# Altium schematic sheet 1-MCU.SchDoc
size A3
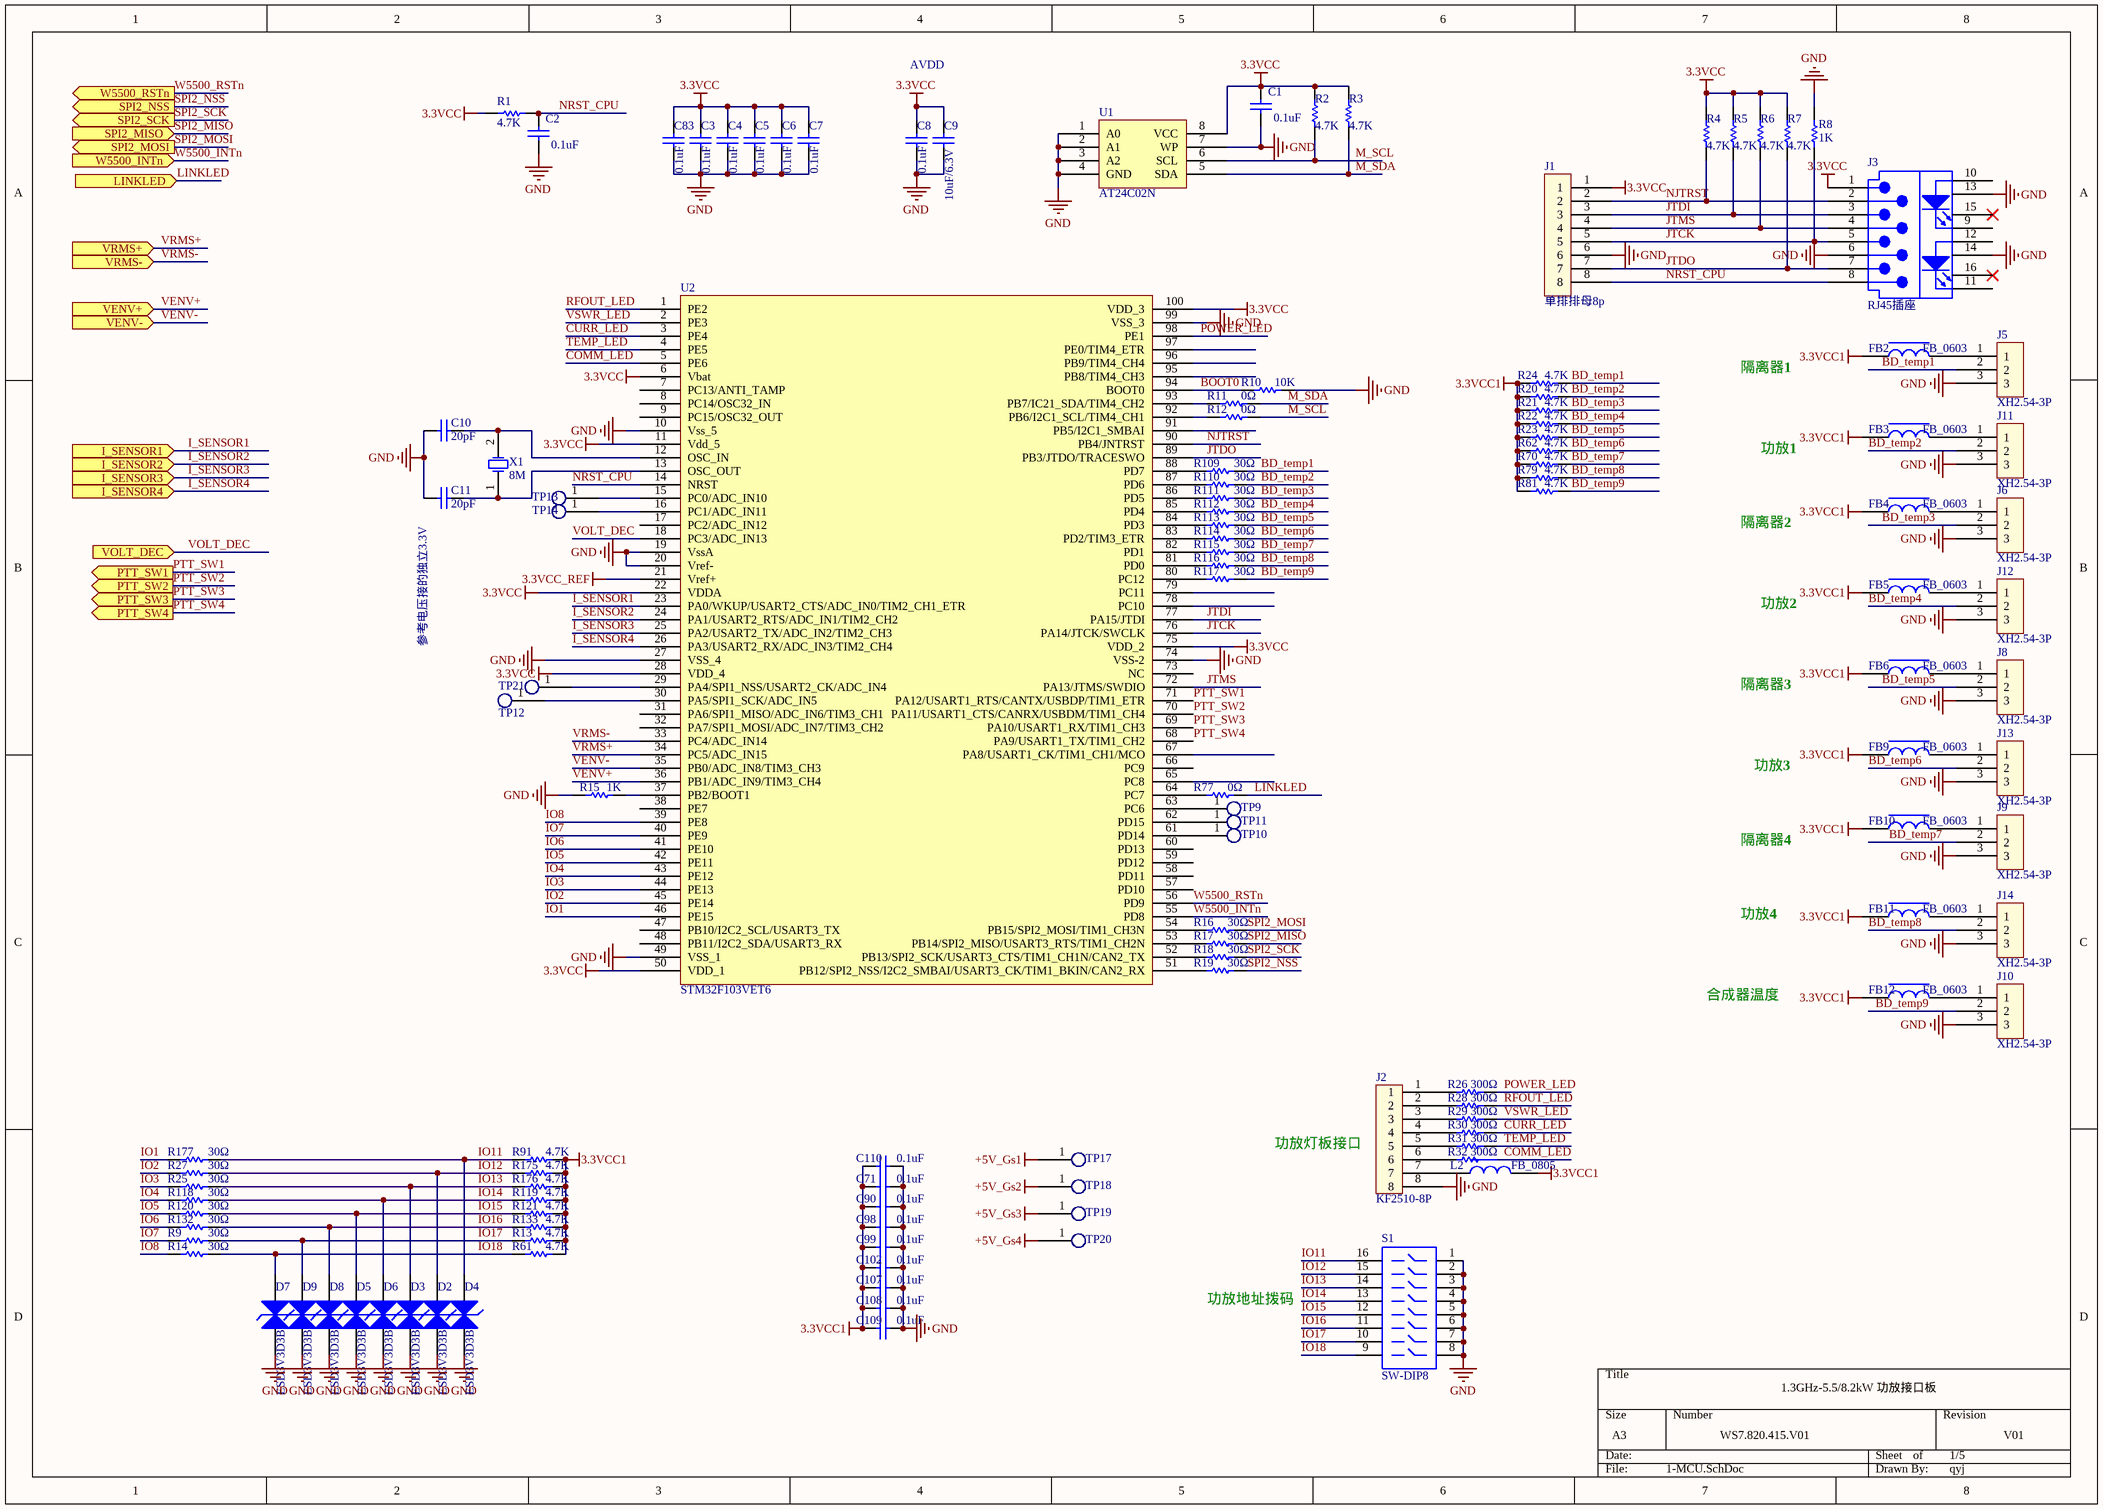
[diagram p0: 1-MCU.SchDoc]

## Parts
C1  0.1uF  [C0603]
C2  0.1uF  [C0603]
C3  0.1uF  [C0603]
C4  0.1uF  [C0603]
C5  0.1uF  [C0603]
C6  0.1uF  [C0603]
C7  0.1uF  [C0603]
C8  0.1uF  [C0603]
C9  10uF/6.3V  [C0603]
C10  20pF  [C0603]
C11  20pF  [C0603]
C71  0.1uF  [C0603]
C83  0.1uF  [C0603]
C90  0.1uF  [C0603]
C98  0.1uF  [C0603]
C99  0.1uF  [C0603]
C102  0.1uF  [C0603]
C107  0.1uF  [C0603]
C108  0.1uF  [C0603]
C109  0.1uF  [C0603]
C110  0.1uF  [C0603]
D2  ESD3V3D3B  [SOD-323]
D3  ESD3V3D3B  [SOD-323]
D4  ESD3V3D3B  [SOD-323]
D5  ESD3V3D3B  [SOD-323]
D6  ESD3V3D3B  [SOD-323]
D7  ESD3V3D3B  [SOD-323]
D8  ESD3V3D3B  [SOD-323]
D9  ESD3V3D3B  [SOD-323]
FB2  FB_0603  [L0603]
FB3  FB_0603  [L0603]
FB4  FB_0603  [L0603]
FB5  FB_0603  [L0603]
FB6  FB_0603  [L0603]
FB9  FB_0603  [L0603]
FB10  FB_0603  [L0603]
FB11  FB_0603  [L0603]
FB12  FB_0603  [L0603]
J1  单排排母8p  [SIP8TM-2R54]
J2  KF2510-8P  [KF2510-8P -2R54-20R32x6R0-wanzhen]
J3  RJ45插座  [RJ45TH-1x1-2R54-LED]
J5  XH2.54-3P  [XH2.54mm-10R0x7R0--zhizhen]
J6  XH2.54-3P  [XH2.54mm-10R0x7R0--zhizhen]
J8  XH2.54-3P  [XH2.54mm-10R0x7R0--zhizhen]
J9  XH2.54-3P  [XH2.54mm-10R0x7R0--zhizhen]
J10  XH2.54-3P  [XH2.54mm-10R0x7R0--zhizhen]
J11  XH2.54-3P  [XH2.54mm-10R0x7R0--zhizhen]
J12  XH2.54-3P  [XH2.54mm-10R0x7R0--zhizhen]
J13  XH2.54-3P  [XH2.54mm-10R0x7R0--zhizhen]
J14  XH2.54-3P  [XH2.54mm-10R0x7R0--zhizhen]
L2  FB_0805  [L0805]
R1  4.7K  [R0603]
R2  4.7K  [R0603]
R3  4.7K  [R0603]
R4  4.7K  [R0603]
R5  4.7K  [R0603]
R6  4.7K  [R0603]
R7  4.7K  [R0603]
R8  1K  [R0603]
R9  30Ω  [R0603]
R10  10K  [R0603]
R11  0Ω  [R0603]
R12  0Ω  [R0603]
R13  4.7K  [R0603]
R14  30Ω  [R0603]
R15  1K  [R0603]
R16  30Ω  [R0603]
R17  30Ω  [R0603]
R18  30Ω  [R0603]
R19  30Ω  [R0603]
R20  4.7K  [R0603]
R21  4.7K  [R0603]
R22  4.7K  [R0603]
R23  4.7K  [R0603]
R24  4.7K  [R0603]
R25  30Ω  [R0603]
R26  300Ω  [R0603]
R27  30Ω  [R0603]
R28  300Ω  [R0603]
R29  300Ω  [R0603]
R30  300Ω  [R0603]
R31  300Ω  [R0603]
R32  300Ω  [R0603]
R61  4.7K  [R0603]
R62  4.7K  [R0603]
R70  4.7K  [R0603]
R77  0Ω  [R0603]
R79  4.7K  [R0603]
R81  4.7K  [R0603]
R91  4.7K  [R0603]
R109  30Ω  [R0603]
R110  30Ω  [R0603]
R111  30Ω  [R0603]
R112  30Ω  [R0603]
R113  30Ω  [R0603]
R114  30Ω  [R0603]
R115  30Ω  [R0603]
R116  30Ω  [R0603]
R117  30Ω  [R0603]
R118  30Ω  [R0603]
R119  4.7K  [R0603]
R120  30Ω  [R0603]
R121  4.7K  [R0603]
R132  30Ω  [R0603]
R133  4.7K  [R0603]
R175  4.7K  [R0603]
R176  4.7K  [R0603]
R177  30Ω  [R0603]
S1  SW-DIP8  [DIP-16-KEY]
TP9  TEST  [TP0R8]  (value not drawn)  (no BOM)
TP10  TEST  [TP0R8]  (value not drawn)  (no BOM)
TP11  TEST  [TP0R8]  (value not drawn)  (no BOM)
TP12  TEST  [TP0R8]  (value not drawn)  (no BOM)
TP13  TEST  [TP0R8]  (value not drawn)  (no BOM)
TP14  TEST  [TP0R8]  (value not drawn)  (no BOM)
TP17  (no value)  [TP2R54mm]  (no BOM)
TP18  (no value)  [TP2R54mm]  (no BOM)
TP19  (no value)  [TP2R54mm]  (no BOM)
TP20  (no value)  [TP2R54mm]  (no BOM)
TP21  TEST  [TP0R8]  (value not drawn)  (no BOM)
U1  AT24C02N  [SOIC8_1R27_3R9x4R9]
U2  STM32F103VET6  [LQFP100_0R5_14x14]
X1  8M  [CRY2SM-6R0x3R5]

## Ports
I_SENSOR1 (in), I_SENSOR2 (in), I_SENSOR3 (in), I_SENSOR4 (in), LINKLED (in), PTT_SW1 (out), PTT_SW2 (out), PTT_SW3 (out), PTT_SW4 (out), SPI2_MISO (in), SPI2_MOSI (out), SPI2_NSS (out), SPI2_SCK (out), VENV+ (in), VENV- (in), VOLT_DEC (in), VRMS+ (in), VRMS- (in), W5500_INTn (in), W5500_RSTn (out)

## Nets
3.3VCC: C1.2 C3.2 C4.2 C5.2 C6.2 C7.2 C8.2 C9.2 C83.2 J1.1 J3.1(TX+) R1.2 R2.2 R3.2 R4.2 R5.2 R6.2 R7.2 U1.8(VCC) U2.6(Vbat) U2.11(Vdd_5) U2.22(VDDA) U2.28(VDD_4) U2.50(VDD_1) U2.75(VDD_2) U2.100(VDD_3)
3.3VCC1: C71.1 C90.1 C98.1 C99.1 C102.1 C107.1 C108.1 C109.1 C110.1 FB2.1 FB3.1 FB4.1 FB5.1 FB6.1 FB9.1 FB10.1 FB11.1 FB12.1 L2.2 R13.1 R20.1 R21.1 R22.1 R23.1 R24.1 R61.1 R62.1 R70.1 R79.1 R81.1 R91.1 R119.1 R121.1 R133.1 R175.1 R176.1
3.3VCC_REF: U2.21(Vref+)
+5V_Gs1: TP17.1(TP)
+5V_Gs2: TP18.1(TP)
+5V_Gs3: TP19.1(TP)
+5V_Gs4: TP20.1(TP)
GND: C1.1 C2.1 C3.1 C4.1 C5.1 C6.1 C7.1 C8.1 C9.1 C10.2 C11.2 C71.2 C83.1 C90.2 C98.2 C99.2 C102.2 C107.2 C108.2 C109.2 C110.2 D2.2 D3.2 D4.2 D5.2 D6.2 D7.2 D8.2 D9.2 J1.6 J2.8 J3.6(RX-) J3.13 J3.14 J5.3 J6.3 J8.3 J9.3 J10.3 J11.3 J12.3 J13.3 J14.3 R8.1 R10.1 R15.1 S1.1 S1.2 S1.3 S1.4 S1.5 S1.6 S1.7 S1.8 U1.1(A0) U1.2(A1) U1.3(A2) U1.4(GND) U1.7(WP) U2.10(Vss_5) U2.19(VssA) U2.20(Vref-) U2.27(VSS_4) U2.49(VSS_1) U2.74(VSS-2) U2.99(VSS_3)
BD_temp1: J5.2 R24.2 R109.2
BD_temp2: J11.2 R20.2 R110.2
BD_temp3: J6.2 R21.2 R111.2
BD_temp4: J12.2 R22.2 R112.2
BD_temp5: J8.2 R23.2 R113.2
BD_temp6: J13.2 R62.2 R114.2
BD_temp7: J9.2 R70.2 R115.2
BD_temp8: J14.2 R79.2 R116.2
BD_temp9: J10.2 R81.2 R117.2
BOOT0: R10.2 U2.94(BOOT0)
COMM_LED: R32.2 U2.5(PE6)
CURR_LED: R30.2 U2.3(PE4)
I_SENSOR1: U2.23(PA0/WKUP/USART2_CTS/ADC_IN0/TIM2_CH1_ETR) ; port I_SENSOR1
I_SENSOR2: U2.24(PA1/USART2_RTS/ADC_IN1/TIM2_CH2) ; port I_SENSOR2
I_SENSOR3: U2.25(PA2/USART2_TX/ADC_IN2/TIM2_CH3) ; port I_SENSOR3
I_SENSOR4: U2.26(PA3/USART2_RX/ADC_IN3/TIM2_CH4) ; port I_SENSOR4
IO1: R177.2 U2.46(PE15)
IO2: R27.2 U2.45(PE14)
IO3: R25.2 U2.44(PE13)
IO4: R118.2 U2.43(PE12)
IO5: R120.2 U2.42(PE11)
IO6: R132.2 U2.41(PE10)
IO7: R9.2 U2.40(PE9)
IO8: R14.2 U2.39(PE8)
IO11: D4.1 R91.2 R177.1 S1.16
IO12: D2.1 R27.1 R175.2 S1.15
IO13: D3.1 R25.1 R176.2 S1.14
IO14: D6.1 R118.1 R119.2 S1.13
IO15: D5.1 R120.1 R121.2 S1.12
IO16: D8.1 R132.1 R133.2 S1.11
IO17: D9.1 R9.1 R13.2 S1.10
IO18: D7.1 R14.1 R61.2 S1.9
JTCK: J1.5 J3.5(NC) R8.2 U2.76(PA14/JTCK/SWCLK)
JTDI: J1.3 J3.3(RX+) R5.1 U2.77(PA15/JTDI)
JTDO: J1.7 J3.7(NC) R7.1 U2.89(PB3/JTDO/TRACESWO)
JTMS: J1.4 J3.4(NC) R6.1 U2.72(PA13/JTMS/SWDIO)
LINKLED: R77.2 ; port LINKLED
M_SCL: R2.1 R12.2 U1.6(SCL)
M_SDA: R3.1 R11.2 U1.5(SDA)
NJTRST: J1.2 J3.2(TX-) R4.1 U2.90(PB4/JNTRST)
NRST_CPU: C2.2 J1.8 J3.8(NC) R1.1 U2.14(NRST)
POWER_LED: R26.2 U2.98(PE1)
PTT_SW1: U2.71(PA12/USART1_RTS/CANTX/USBDP/TIM1_ETR) ; port PTT_SW1
PTT_SW2: U2.70(PA11/USART1_CTS/CANRX/USBDM/TIM1_CH4) ; port PTT_SW2
PTT_SW3: U2.69(PA10/USART1_RX/TIM1_CH3) ; port PTT_SW3
PTT_SW4: U2.68(PA9/USART1_TX/TIM1_CH2) ; port PTT_SW4
RFOUT_LED: R28.2 U2.1(PE2)
SPI2_MISO: R17.2 ; port SPI2_MISO
SPI2_MOSI: R16.2 ; port SPI2_MOSI
SPI2_NSS: R19.2 ; port SPI2_NSS
SPI2_SCK: R18.2 ; port SPI2_SCK
TEMP_LED: R31.2 U2.4(PE5)
VENV+: U2.36(PB1/ADC_IN9/TIM3_CH4) ; port VENV+
VENV-: U2.35(PB0/ADC_IN8/TIM3_CH3) ; port VENV-
VOLT_DEC: U2.18(PC3/ADC_IN13) ; port VOLT_DEC
VRMS+: U2.34(PC5/ADC_IN15) ; port VRMS+
VRMS-: U2.33(PC4/ADC_IN14) ; port VRMS-
VSWR_LED: R29.2 U2.2(PE3)
W5500_INTn: U2.55(PD8) ; port W5500_INTn
W5500_RSTn: U2.56(PD9) ; port W5500_RSTn
NetC10_1: C10.1 U2.12(OSC_IN) X1.2(OSC2)
NetC11_1: C11.1 U2.13(OSC_OUT) X1.1(OSC1)
NetFB2_2: FB2.2 J5.1
NetFB3_2: FB3.2 J11.1
NetFB4_2: FB4.2 J6.1
NetFB5_2: FB5.2 J12.1
NetFB6_2: FB6.2 J8.1
NetFB9_2: FB9.2 J13.1
NetFB10_2: FB10.2 J9.1
NetFB11_2: FB11.2 J14.1
NetFB12_2: FB12.2 J10.1
NetJ2_1: J2.1 R26.1
NetJ2_2: J2.2 R28.1
NetJ2_3: J2.3 R29.1
NetJ2_4: J2.4 R30.1
NetJ2_5: J2.5 R31.1
NetJ2_6: J2.6 R32.1
NetJ2_7: J2.7 L2.1
NetR11_1: R11.1 U2.93(PB7/IC21_SDA/TIM4_CH2)
NetR12_1: R12.1 U2.92(PB6/I2C1_SCL/TIM4_CH1)
NetR15_2: R15.2 U2.37(PB2/BOOT1)
NetR16_1: R16.1 U2.54(PB15/SPI2_MOSI/TIM1_CH3N)
NetR17_1: R17.1 U2.53(PB14/SPI2_MISO/USART3_RTS/TIM1_CH2N)
NetR18_1: R18.1 U2.52(PB13/SPI2_SCK/USART3_CTS/TIM1_CH1N/CAN2_TX)
NetR19_1: R19.1 U2.51(PB12/SPI2_NSS/I2C2_SMBAI/USART3_CK/TIM1_BKIN/CAN2_RX)
NetR77_1: R77.1 U2.64(PC7)
NetR109_1: R109.1 U2.88(PD7)
NetR110_1: R110.1 U2.87(PD6)
NetR111_1: R111.1 U2.86(PD5)
NetR112_1: R112.1 U2.85(PD4)
NetR113_1: R113.1 U2.84(PD3)
NetR114_1: R114.1 U2.83(PD2/TIM3_ETR)
NetR115_1: R115.1 U2.82(PD1)
NetR116_1: R116.1 U2.81(PD0)
NetR117_1: R117.1 U2.80(PC12)
NetTP9_1: TP9.1(TP) U2.63(PC6)
NetTP10_1: TP10.1(TP) U2.61(PD14)
NetTP11_1: TP11.1(TP) U2.62(PD15)
NetTP12_1: TP12.1(TP) U2.30(PA5/SPI1_SCK/ADC_IN5)
NetTP13_1: TP13.1(TP) U2.15(PC0/ADC_IN10)
NetTP14_1: TP14.1(TP) U2.16(PC1/ADC_IN11)
NetTP21_1: TP21.1(TP) U2.29(PA4/SPI1_NSS/USART2_CK/ADC_IN4)

Not connected (* = marked no-connect by the designer): J3 9(K1) 10(A1) 11(K2) 12(A2) 15* 16*; U2 7(PC13/ANTI_TAMP) 8(PC14/OSC32_IN) 9(PC15/OSC32_OUT) 17(PC2/ADC_IN12) 31(PA6/SPI1_MISO/ADC_IN6/TIM3_CH1) 32(PA7/SPI1_MOSI/ADC_IN7/TIM3_CH2) 38(PE7) 47(PB10/I2C2_SCL/USART3_TX) 48(PB11/I2C2_SDA/USART3_RX) 57(PD10) 58(PD11) 59(PD12) 60(PD13) 65(PC8) 66(PC9) 67(PA8/USART1_CK/TIM1_CH1/MCO) 73(NC) 78(PC10) 79(PC11) 91(PB5/I2C1_SMBAI) 95(PB8/TIM4_CH3) 96(PB9/TIM4_CH4) 97(PE0/TIM4_ETR)

## Notes on the sheet
- AVDD
- 隔离器1
- 功放1
- 隔离器2
- 参考电压接的独立3.3V
- 功放2
- 隔离器3
- 功放3
- 隔离器4
- 功放4
- 合成器温度
- 功放灯板接口
- 功放地址拨码
- 1.3GHz-5.5/8.2kW 功放接口板
- WS7.820.415.V01
- 1/5
- V01
- qyj

## Library data of the parts
C1-C8 C83 = 0.1uF贴片电容: 贴片电容_GRM188R71H104KA01D_0.1uF±10%,50V,0603; code: 01010045
C9 = 10uF贴片电容: 贴片电容_GRM188R60J106ME47D_10uF±20%,6.3V,0603; code: 01010037
C10 C11 = 20pF贴片电容: 贴片电容_GRM188C1H200JB01D_20pF±5%,50V,0603; code: 01010035
C71 C90 C98 C99 C102 C107-C110 = 0.1uF: GRM188R71H104KA01D; MPN: MURATA; WSPN: 01010045
D2-D9 = ESD5B5.0ST1G: ESD_ESD3V3D3B_SOD-323,3.3V,双管
FB2-FB6 FB9-FB12 = 0603贴片磁珠: 贴片磁珠_100R,0603; code: 0103016
J1 = 8p-2.54单排母座: 连接器_单排排母座8p_直插,间距2.54mm; MPN: WS; code: 01090052
J2 = KF2510-8P弯针: 连接器_KF2510-8P_90°弯针,间距2.54mm
J3 = RJ45弯脚带灯: RJ45插座_1*1,带左黄右绿灯,弯脚; MPN: 朱迅; code: 01090042
J5 J6 J8-J14 = XH2.54-3P: 连接器_XH2.54-3P_弯针,间距2.54mm
L2 = 0805贴片磁珠: 贴片磁珠_600R,0805; code: 01030023
R1-R7 R13 R20-R24 R61 R62 R70 R79 R81 R91 R119 R121 R133 R175 R176 = 4.7K贴片电阻: 贴片电阻_4.7K±5%,0603; code: 01020012
R8 R15 = 1K贴片电阻: 贴片电阻_1K±5%,0603; code: 01020082
R9 R14 R25 R27 R118 R120 R132 R177 = 0Ω贴片电阻: 贴片电阻_30Ω±5%,0603; code: 01020010
R10 = 10K贴片电阻: 贴片电阻_10K±5%,0603; code: 01020011
R11 R12 R77 = 0Ω贴片电阻: 贴片电阻_0Ω±5%,0603; code: 01020010
R16-R19 R109-R117 = 30Ω贴片电阻: 贴片电阻_30Ω±5%,0603; code: 01020108
R26 R28-R32 = 300Ω贴片电阻: 贴片电阻_300Ω±5%,0603; code: 01020008
S1 = SW-DIP8: 4009 Series DIP Switch, Raised actuator; Published: 24-Mar-1999; LatestRevisionDate: 17-Dec-2003; LatestRevisionNote: PCB Footprint replaced.; PackageReference: DIP-16-KEY; Publisher: Altium Limited; PackageDescription: DIP; 16 Leads; Row Spacing 7.62 mm; Pitch 2.54 mm; ComponentLink1Description: Manufacturer Link; ComponentLink1URL: http://www.oupiin.com/prodindx.html#Headers
TP9-TP14 TP21 = TP0.8mm: 表贴测试点0.8mm
TP17-TP20 = TP2mm: 表贴测试点1mm
U1 = AT24C02N: EEPROM_AT24C02N_SOIC8; Maker: ATMEL; code: 01060068
U2 = STM32F103VET: MCU_STM32F103VET6_32 bit, LQFP100; Maker: ST; code: 01060037
X1 = 8M贴片无源晶体: 贴片无源晶体_8MHz,封装6035; code: 03050006